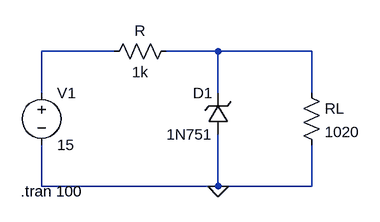
[diagram p0: schematic zener_diode_1.asc]
zener_diode_1.asc, the LTspice schematic file:
Version 4
SHEET 1 880 680
WIRE 224 80 112 80
WIRE 384 80 304 80
WIRE 528 80 384 80
WIRE 112 144 112 80
WIRE 384 144 384 80
WIRE 528 144 528 80
WIRE 112 288 112 224
WIRE 384 288 384 208
WIRE 384 288 112 288
WIRE 528 288 528 224
WIRE 528 288 384 288
FLAG 384 288 0
SYMBOL voltage 112 128 R0
WINDOW 123 0 0 Left 0
WINDOW 39 0 0 Left 0
SYMATTR InstName V1
SYMATTR Value 15
SYMBOL res 320 64 R90
WINDOW 0 0 56 VBottom 2
WINDOW 3 32 56 VTop 2
SYMATTR InstName R
SYMATTR Value 1k
SYMBOL res 512 128 R0
SYMATTR InstName RL
SYMATTR Value 1020
SYMBOL zener 400 208 R180
WINDOW 0 24 64 Left 2
WINDOW 3 24 0 Left 2
SYMATTR InstName D1
SYMATTR Value 1N751
SYMATTR Description Diode
SYMATTR Type diode
TEXT 80 296 Left 2 !.tran 100

The netlist it stands for:
* zener_diode_1.asc
V1 N001 0 15
R N002 N001 1k
RL N002 0 1020
D1 0 N002 1N751
.model D D
.lib standard.dio
.tran 100
.backanno
.end